# EAGLE design untitled (EAGLE 9.2.2)
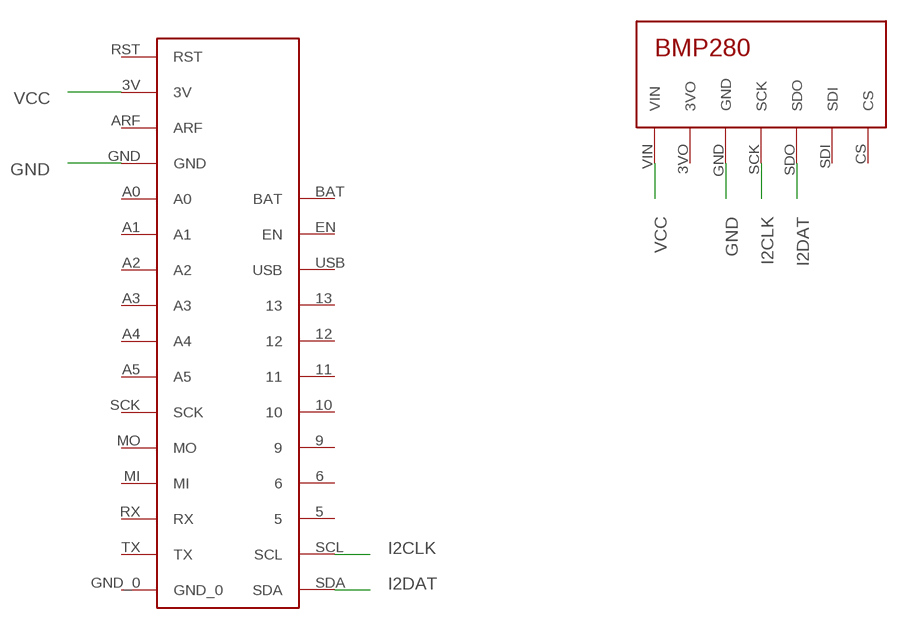
[diagram p0: schematic, sheet 1]

## Parts
U$1  M0  [M0]
U$2  BMP  [BMP]

## Nets
GND: U$1.GND U$2.GND
I2CLK: U$1.SCL U$2.SCK
I2DAT: U$1.SDA U$2.SDO
VCC: U$1.3V U$2.VIN
Unconnected: U$1.5 U$1.6 U$1.9 U$1.10 U$1.11 U$1.12 U$1.13 U$1.A0 U$1.A1 U$1.A2 U$1.A3 U$1.A4 U$1.A5 U$1.ARF U$1.BAT U$1.EN U$1.GND_0 U$1.MI U$1.MO U$1.RST U$1.RX U$1.SCK U$1.TX U$1.USB U$2.3VO U$2.CS U$2.SDI

## Library data of the parts
U$1 = M0:M0
U$2 = M0:BMP

## Board
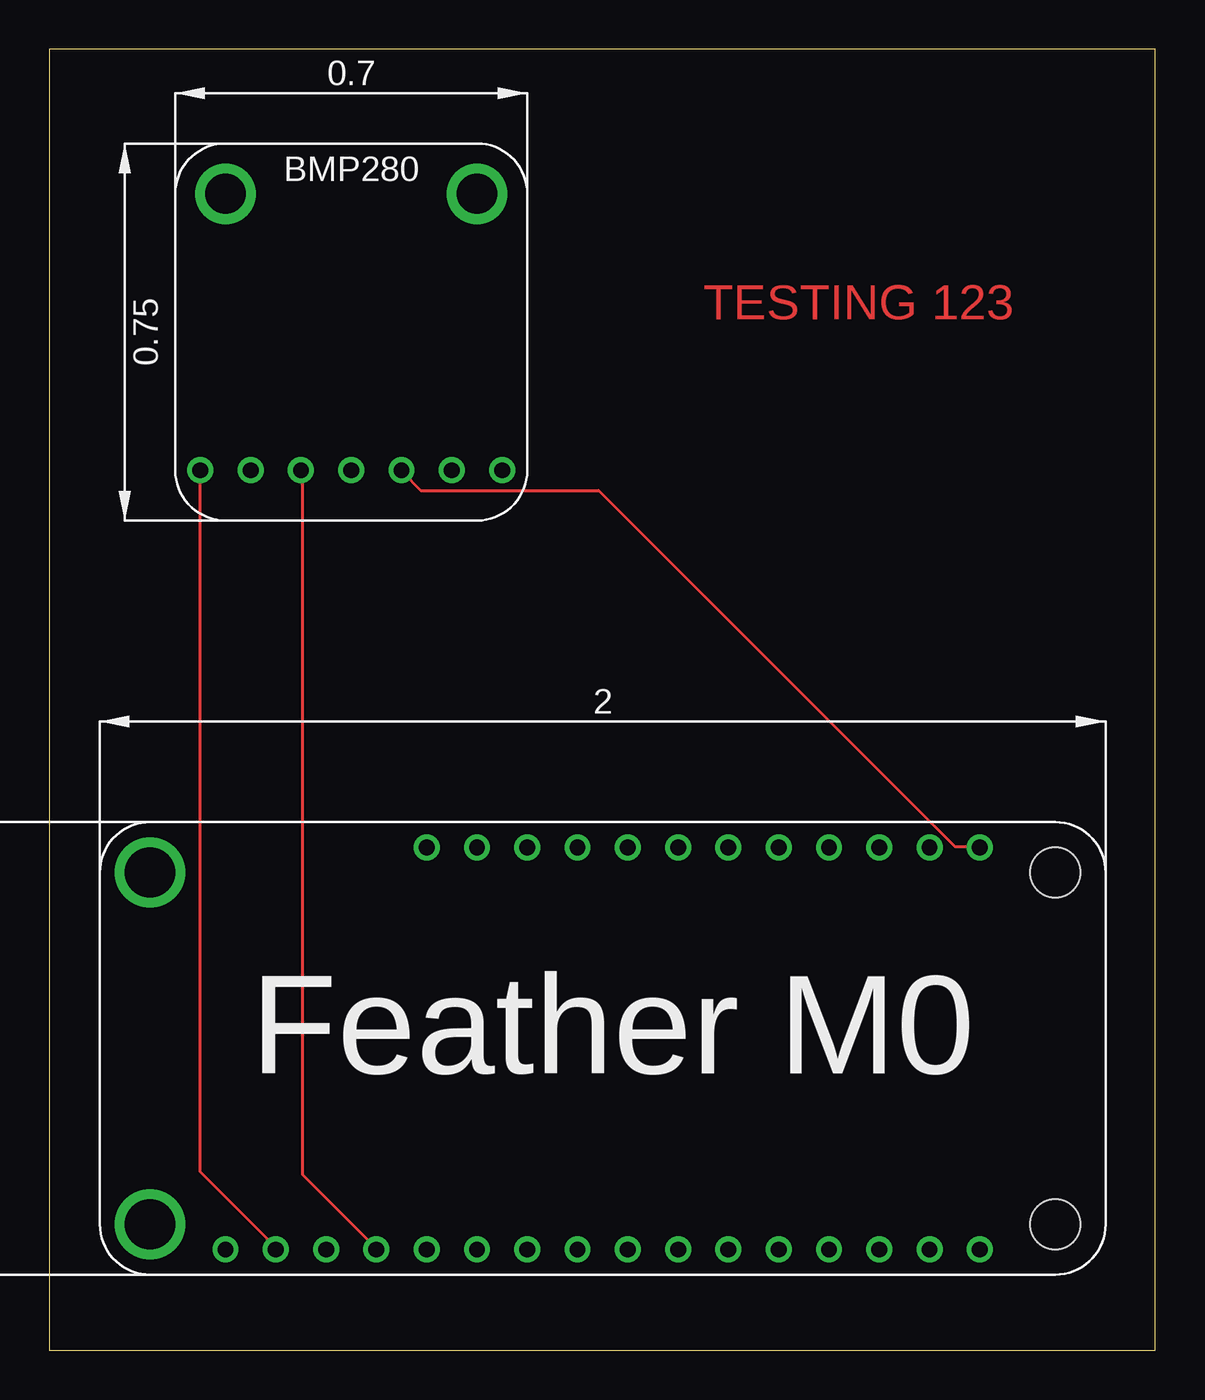
[diagram p1: board, top side]
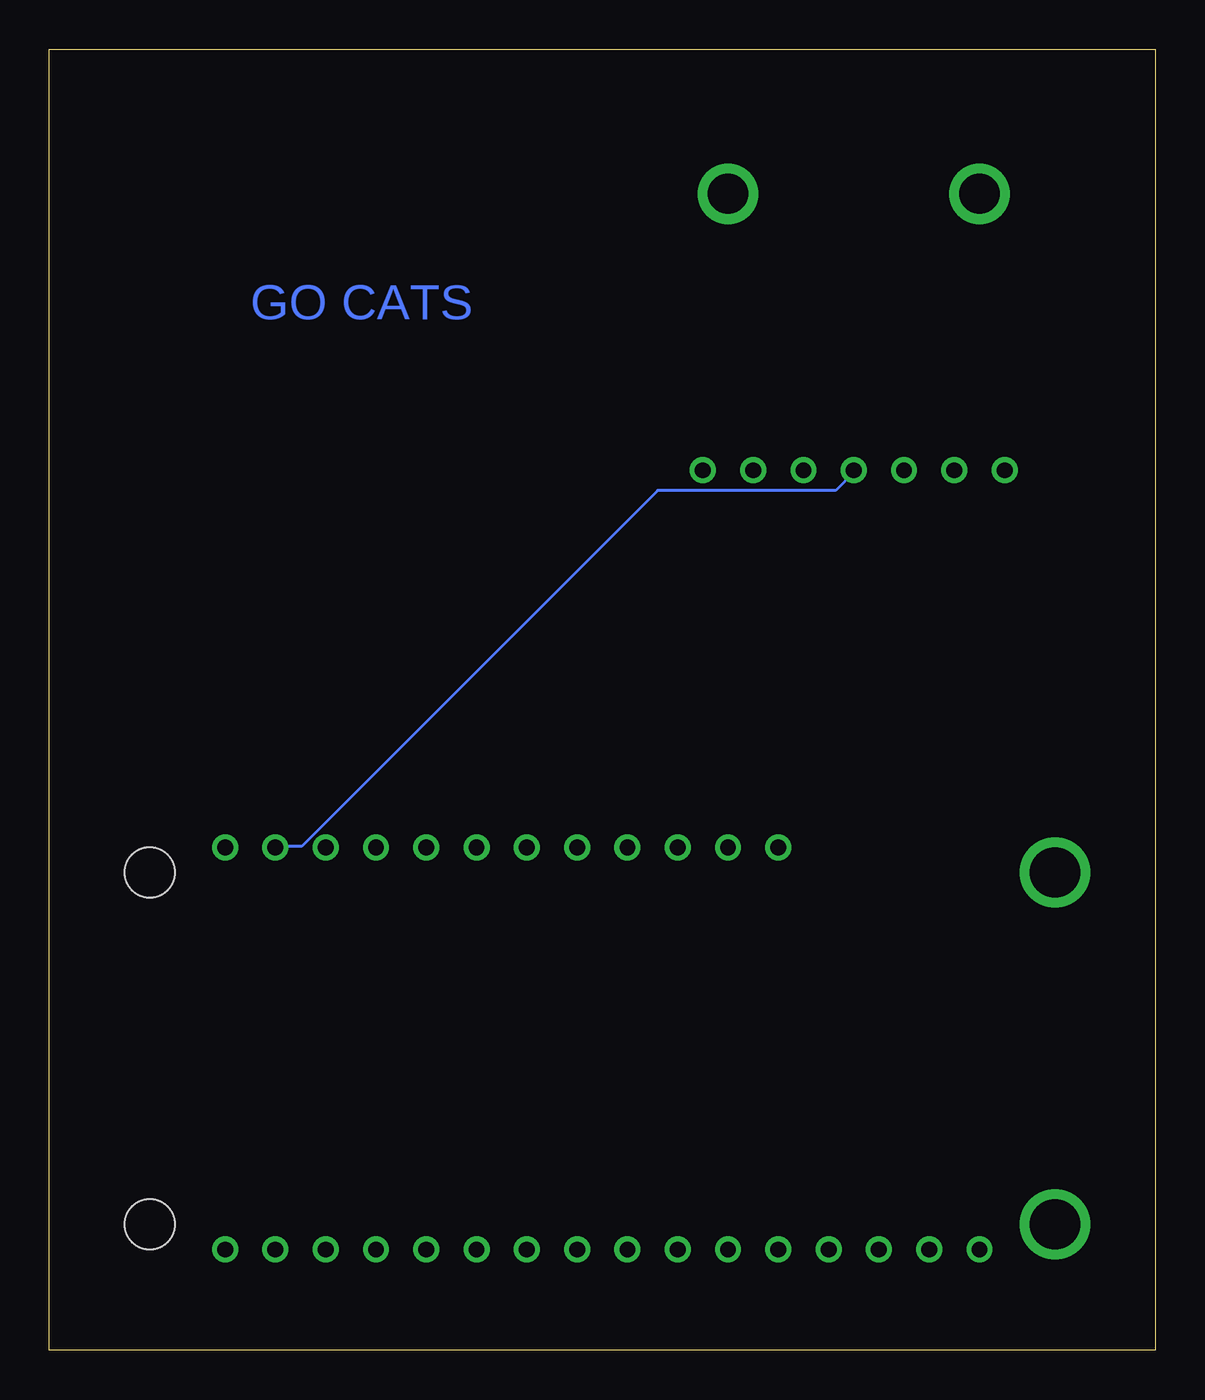
[diagram p2: board, bottom side, seen from below]

Size 55.86 x 65.71 mm. Coordinates in mm from the lower left corner, seen from the top.
Outline: 0,0 55.86,0 55.86,65.71 0,65.71 0,0
Copper layers (1*16): Top 0.035mm / dielectric 1.5mm / Bottom 0.035mm
Design rules "default": minimum track width 6mil, minimum drill 0.35mm, track to track 6mil, track to pad 6mil, pad to pad 6mil, via to via 6mil, smd to smd 6mil, copper to edge 40mil, drill to drill 6mil, minimum pad ring 10mil, minimum via ring 8mil, stop-mask expansion 4mil, vias tented up to drill 0mil, thermal gap 10mil

### Footprints (pad centres in the part's own frame; a part is rotated, then mirrored left to right if it is on the bottom)
M0 = drill 0.8: 3V -6.35,-10.16; 5 24.13,10.16; 6 21.59,10.16; 9 19.05,10.16; 10 16.51,10.16; 11 13.97,10.16; 12 11.43,10.16; 13 8.89,10.16; A0 1.27,-10.16; A1 3.81,-10.16; A2 6.35,-10.16; A3 8.89,-10.16; A4 11.43,-10.16; A5 13.97,-10.16; ARF -3.81,-10.16; BAT 1.27,10.16; EN 3.81,10.16; GND -1.27,-10.16; GND_0 29.21,-10.16; MI 19.05,-10.16; MO 21.59,-10.16; RST -8.89,-10.16; RX 24.13,-10.16; SCK 16.51,-10.16; SCL 26.67,10.16; SDA 29.21,10.16; TX 26.67,-10.16; USB 6.35,10.16 | drill 2.54: A6 -12.7,8.89; A7 -12.7,-8.89 | hole 2.54: 33.02,8.89; 33.02,-8.89
BMP = drill 0.8: 3VO 3.81,2.54; CS 16.51,2.54; GND 6.35,2.54; SCK 8.89,2.54; SDI 13.97,2.54; SDO 11.43,2.54; VIN 1.27,2.54 | drill 2.032: A8 2.54,16.51; A9 15.24,16.51

### Placement (x,y rotation side)
U$1  17.78,15.24 0 top
U$2  6.35,41.91 0 top

### Tracks (layer width: path | path; a pad name or v marks a point on that pad's centre or on a via)
GND
  Top 0.152: U$2.GND 12.8,44.35 12.8,8.84 16.46,5.18 U$1.GND
I2CLK
  Bottom 0.152: U$1.SCL 44.35,25.45 43.13,25.45 25.15,43.43 16.15,43.43 15.24,44.35 U$2.SCK
I2DAT
  Top 0.152: U$1.SDA 46.94,25.45 45.72,25.45 27.74,43.43 18.75,43.43 17.83,44.35 U$2.SDO
VCC
  Top 0.152: U$2.VIN 7.62,8.99 11.43,5.18 U$1.3V

### Text on the board
Top: TESTING 123
Bottom: GO CATS